# EAGLE design feeder_microcontroller_side (EAGLE 9.3.0)
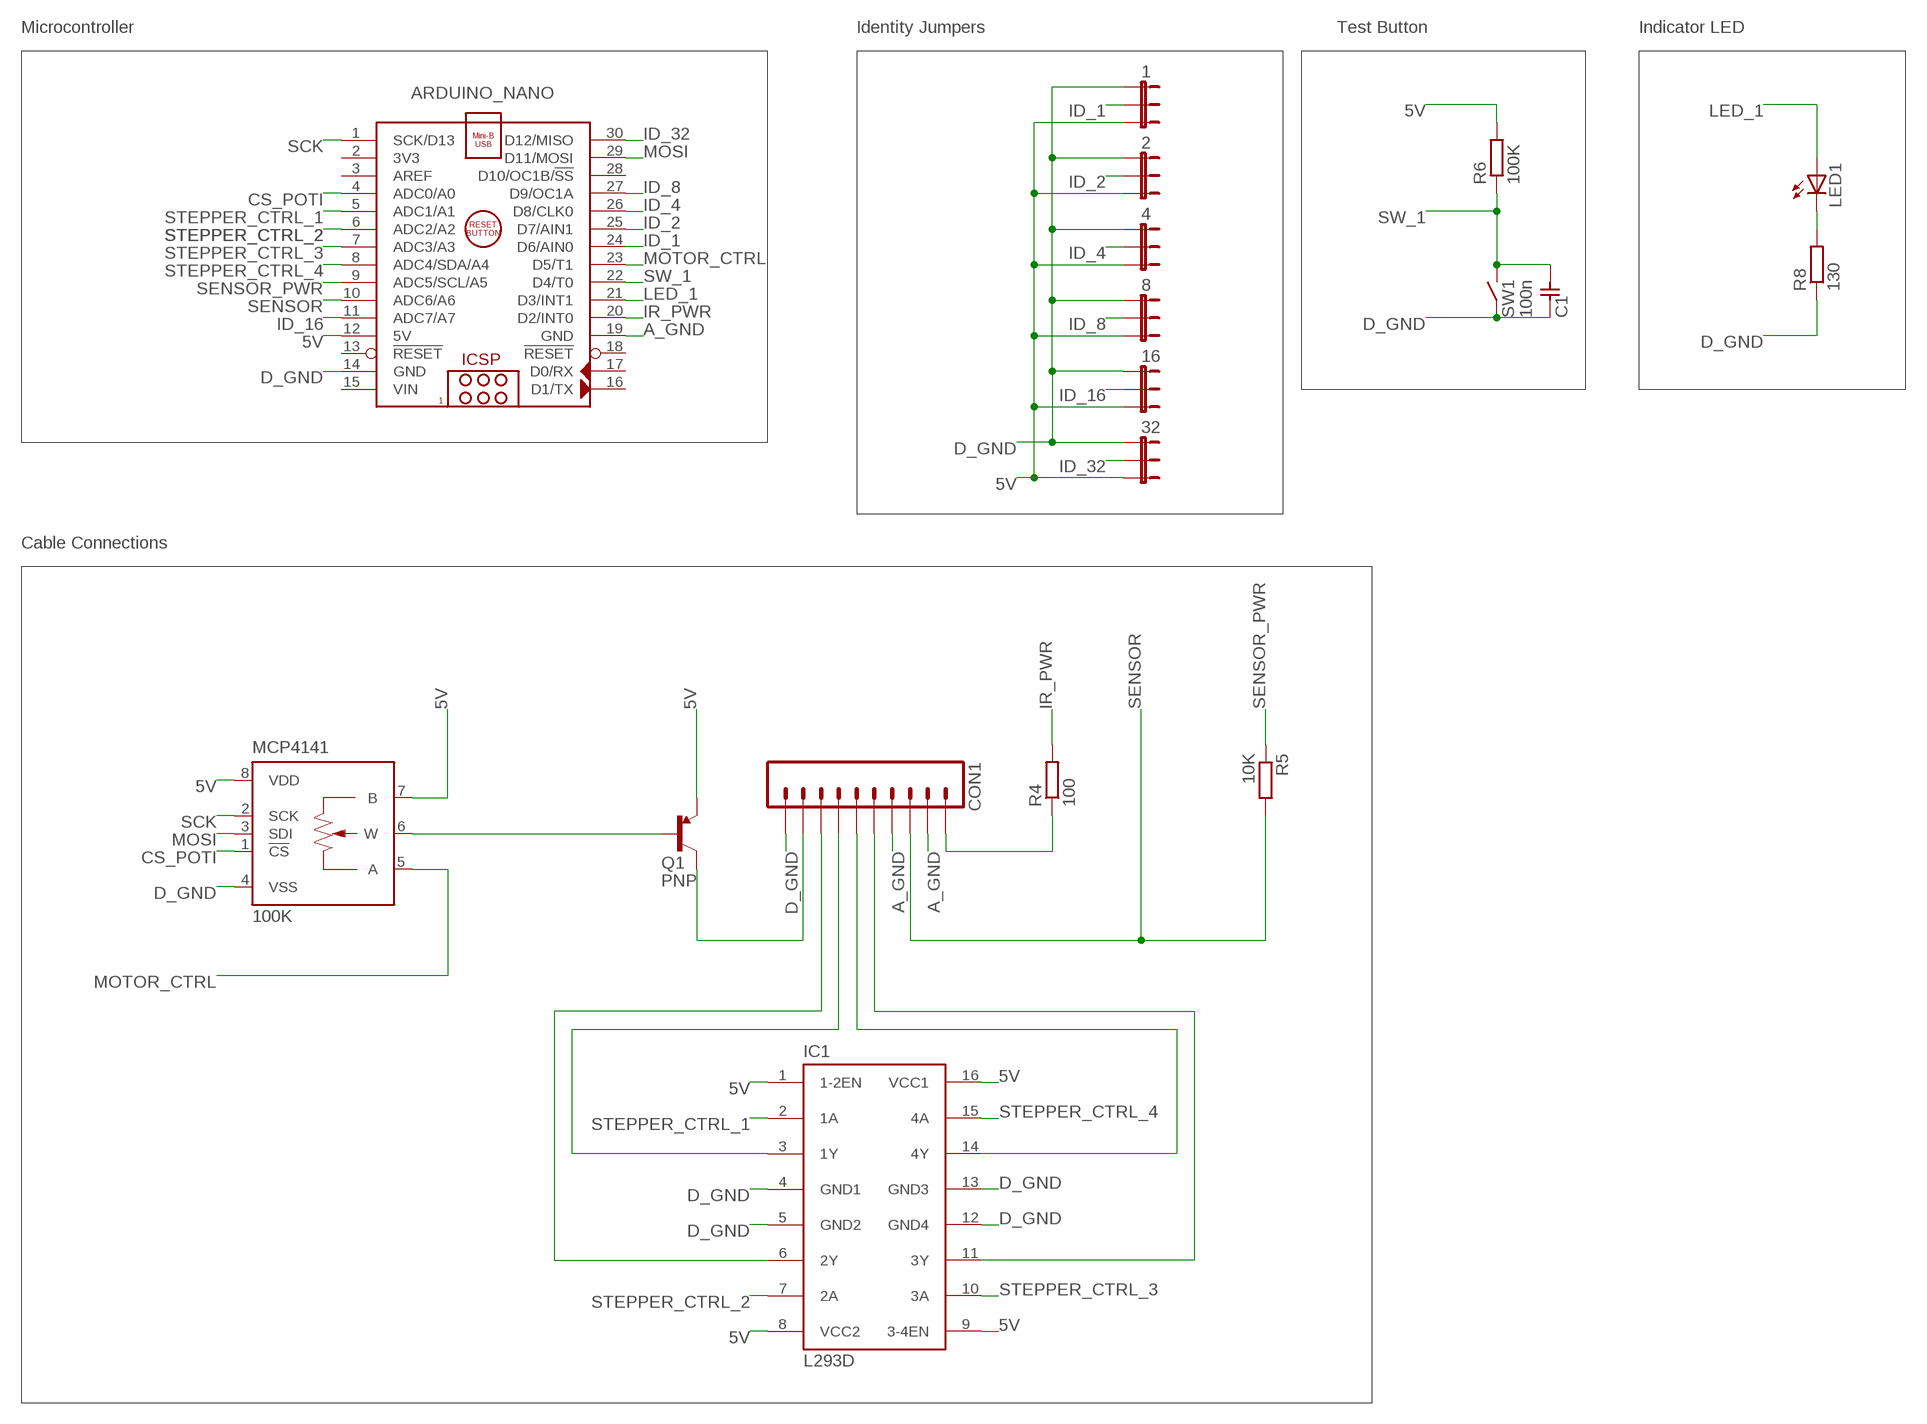
[diagram p0: schematic, sheet 1]

## Parts
1  JP2E  [JP2]
2  JP2E  [JP2]
4  JP2E  [JP2]
8  JP2E  [JP2]
16  JP2E  [JP2]
32  JP2E  [JP2]
ARDUINO_NANO  ARDUINO_NANO  [ARDUINO_NANO]
C1  100n  CAPACITOR  [CAPACITOR]
CON1  CON_10  [CON_10P_1.25_ALIEXPRESS]
IC1  L293D  [DIL16]
LED1  LED_3MM  [TCR5000_IR_EMITTER]
MCP4141  100K  MCP_41X1_DIGI_POT  [DIL08]
Q1  PNP  [TO92-]
R4  100  R-EU_0204/7  [0204/7]
R5  10K  R-EU_0204/7  [0204/7]
R6  100K  R-EU_0204/7  [0204/7]
R8  130  R-EU_0204/7  [0204/7]
SW1  BUTTON  [KS-01Q-01_BUTTON]

## Nets
5V [motor]: 1.3 2.3 4.3 8.3 16.3 32.3 ARDUINO_NANO.12(5V) IC1.1(1-2EN) IC1.8(VCC2) IC1.9(3-4EN) IC1.16(VCC1) MCP4141.7(B) MCP4141.8(VDD) Q1.E R6.2
A_GND: ARDUINO_NANO.19(GND) CON1.2 CON1.4
CS_POTI: ARDUINO_NANO.4(ADC0/A0) MCP4141.1(!CS)
D_GND [motor]: 1.1 2.1 4.1 8.1 16.1 32.1 ARDUINO_NANO.14(GND) C1.P$1 CON1.10 IC1.4(GND1) IC1.5(GND2) IC1.12(GND4) IC1.13(GND3) MCP4141.4(VSS) R8.1 SW1.1 SW1.3
ID_1: 1.2 ARDUINO_NANO.24(D6/AIN0)
ID_2: 2.2 ARDUINO_NANO.25(D7/AIN1)
ID_4: 4.2 ARDUINO_NANO.26(D8/CLK0)
ID_8: 8.2 ARDUINO_NANO.27(D9/OC1A)
ID_16: 16.2 ARDUINO_NANO.11(ADC7/A7)
ID_32: 32.2 ARDUINO_NANO.30(D12/MISO)
IR+: CON1.1 R4.1
IR_PWR: ARDUINO_NANO.20(D2/INT0) R4.2
LED_1: ARDUINO_NANO.21(D3/INT1) LED1.A
MOSI: ARDUINO_NANO.29(D11/MOSI) MCP4141.3(SDI)
MOTOR_CTRL: ARDUINO_NANO.23(D5/T1) MCP4141.5(A)
MOTOR_SUPPLY [motor]: CON1.9 Q1.C
N$16: MCP4141.6(W) Q1.B
N$19: LED1.C R8.2
SCK: ARDUINO_NANO.1(SCK/D13) MCP4141.2(SCK)
SENSOR: ARDUINO_NANO.10(ADC6/A6) CON1.3 R5.2
SENSOR_PWR: ARDUINO_NANO.9(ADC5/SCL/A5) R5.1
STEPPER_CTRL_1: ARDUINO_NANO.5(ADC1/A1) IC1.2(1A)
STEPPER_CTRL_2: ARDUINO_NANO.6(ADC2/A2) IC1.7(2A)
STEPPER_CTRL_3: ARDUINO_NANO.7(ADC3/A3) IC1.10(3A)
STEPPER_CTRL_4: ARDUINO_NANO.8(ADC4/SDA/A4) IC1.15(4A)
STEPPER_PWR_1: CON1.7 IC1.3(1Y)
STEPPER_PWR_2: CON1.8 IC1.6(2Y)
STEPPER_PWR_3: CON1.5 IC1.11(3Y)
STEPPER_PWR_4: CON1.6 IC1.14(4Y)
SW_1: ARDUINO_NANO.22(D4/T0) C1.P$2 R6.1 SW1.2 SW1.4
Unconnected: ARDUINO_NANO.2(3V3) ARDUINO_NANO.3(AREF) ARDUINO_NANO.13(!RESET) ARDUINO_NANO.16(D1/TX) ARDUINO_NANO.17(D0/RX) ARDUINO_NANO.18(!RESET) ARDUINO_NANO.28(D10/OC1B/!SS)

## Notes on the sheet
- Microcontroller | Identity Jumpers | Test Button | Indicator LED
- Cable Connections

## Power pins joined to a net without a drawn wire
VIN: ARDUINO_NANO.15(VIN)

## Library data of the parts
1 2 4 8 16 32 = Skinner_Box_Devices:JP2E: JUMPER
ARDUINO_NANO = Skinner_Box_Devices:ARDUINO_NANO: Arduino Nano V3.0 Module Overview: The Arduino Nano is a small, complete, and breadboard-friendly board based on the ATmega328 (Arduino Nano 3.x) or ATmega168 (Arduino Nano 2.x). It has more or less the same functionality of the Arduino Duemilanove, but in a different package. It lacks only a DC power jack, and works with a Mini-B USB cable instead of a standard one. The Nano was designed and is being produced by Gravitech <http://www.gravitech.us/arna30wiatp.html>. General specifications: Item Value Microcontroller Atmel ATmega168 or ATmega328 Operating Voltage (logic level) 5 V Input Voltage (recommended) 7-12 V Input Voltage (limits) 6-20 V Digital I/O Pins 14 (of which 6 provide PWM output) Analog Input Pins 8 DC Current per I/O Pin 40 mA Flash Memory 16 KB (ATmega168) or 32 KB (ATmega328) of which 2 KB used by bootloader SRAM 1 KB (ATmega168) or 2 KB (ATmega328) EEPROM 512 bytes (ATmega168) or 1 KB (ATmega328) Clock Speed 16 MHz Dimensions (Inches) 0.73" x 1.70" Dimensions (mm) 18mm x 45mm Overall height About 9 mm (not including pins) Weigth 5 g Power: The Arduino Nano can be powered via the Mini-B USB connection, 6-20V unregulated external power supply (pin 30), or 5V regulated external power supply (pin 27). The power source is automatically selected to the highest voltage source. Memory: The ATmega168 has 16 KB of flash memory for storing code (of which 2 KB is used for the bootloader); the ATmega328 has 32 KB, (also with 2 KB used for the bootloader). The ATmega168 has 1 KB of SRAM and 512 bytes of EEPROM (which can be read and written with the EEPROM library); the ATmega328 has 2 KB of SRAM and 1 KB of EEPROM. Input and Output: Each of the 14 digital pins on the Nano can be used as an input or output, using pinMode(), digitalWrite(), and digitalRead() functions. They operate at 5 volts. Each pin can provide or receive a maximum of 40 mA and has an internal pull-up resistor (disconnected by default) of 20-50 kOhms. In addition, some pins have specialized functions. Visit Arduino - ArduinoBoardNano <https://www.arduino.cc/en/Main/ArduinoBoardNano>
C1 = Skinner_Box_Devices:CAPACITOR
CON1 = Skinner_Box_Devices:CON_10
IC1 = Skinner_Box_Devices:L293D: PUSH-PULL 4 CHANNEL DRIVER
LED1 = Skinner_Box_Devices:LED_3MM
MCP4141 = Skinner_Box_Devices:MCP_41X1_DIGI_POT
Q1 = Skinner_Box_Devices:PNP: NPN Transistor
R4-R6 R8 = Skinner_Box_Devices:R-EU_: RESISTOR, European symbol
SW1 = Skinner_Box_Devices:BUTTON

## Net classes
0 default: width 0.1 mm, clearance 0.1 mm
1 motor: width 0.1 mm, clearance 0.2 mm

## Board
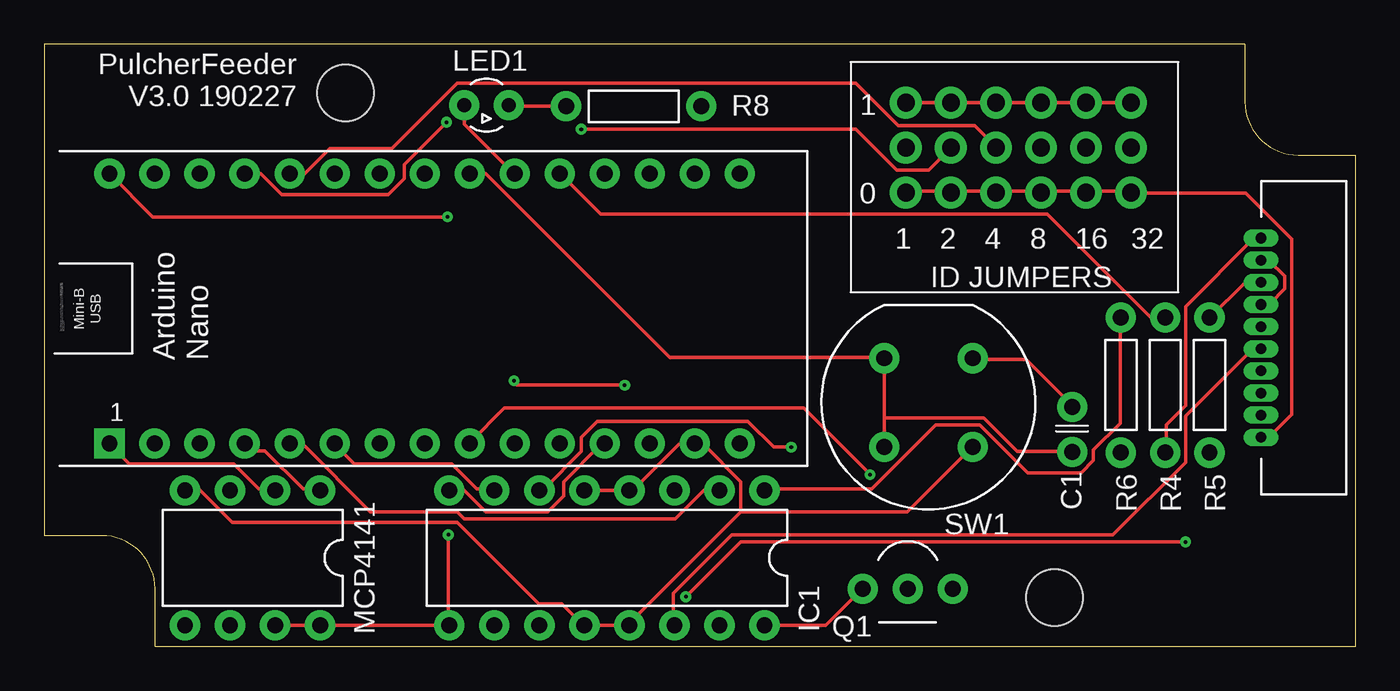
[diagram p1: board, top side]
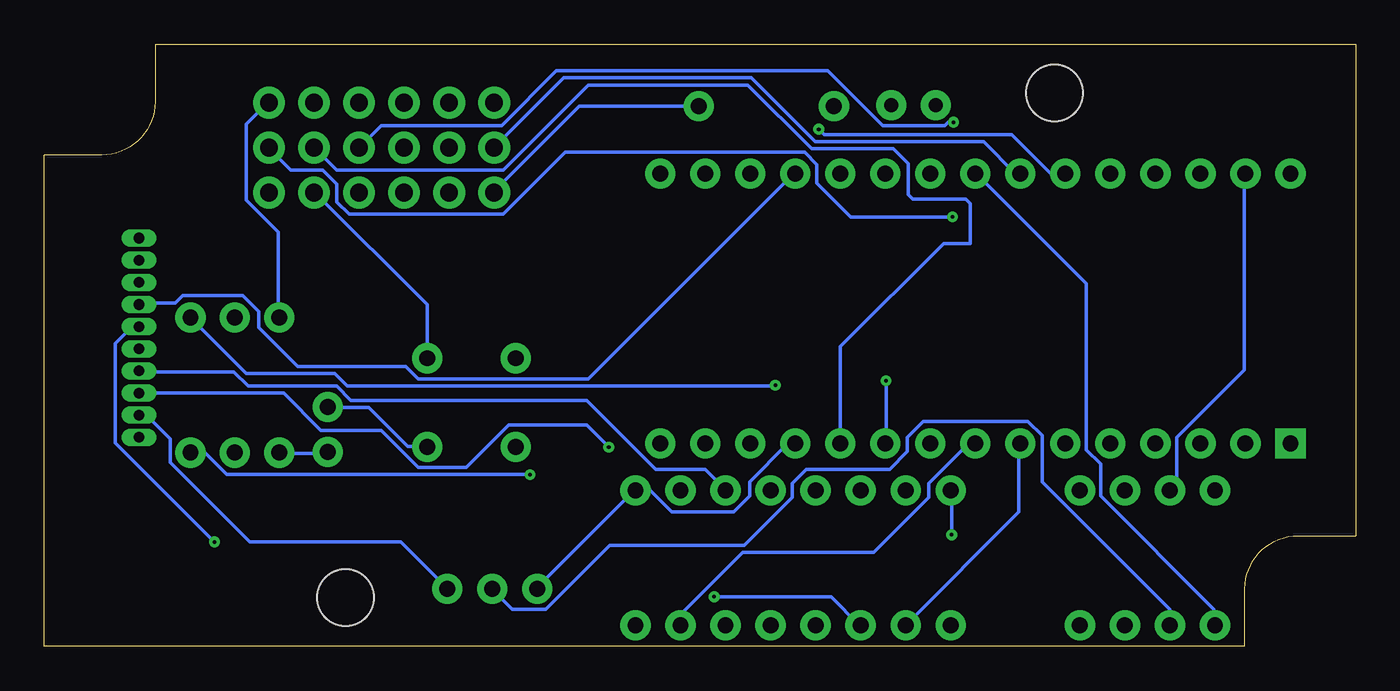
[diagram p2: board, bottom side, seen from below]

Size 74 x 34 mm. Coordinates in mm from the lower left corner, seen from the top.
Outline: 67.75,34 0,34 0,6.25 3.25,6.25 arc-90 6.25,3.25 6.25,0 74,0 74,27.75 70.75,27.75 arc-90 67.75,30.75 67.75,34
Copper layers (1*16): Top 0.035mm / dielectric 1.5mm / Bottom 0.035mm
Design rules "eagle_design_rules_multiCB": minimum track width 0.2mm, minimum drill 0.2mm, track to track 0.2mm, track to pad 0.2mm, pad to pad 0.2mm, via to via 0.2mm, smd to smd 0.2mm, copper to edge 0.2mm, drill to drill 0.2mm, minimum pad ring 0mil, minimum via ring 8mil, stop-mask expansion 4mil, vias tented up to drill 1mm, thermal gap 10mil
Holes 3.2 mm at 17,31.25 57,2.75
tRestrict: area 54,-0.2 to 60,5.8; area 14,28.2 to 20,34.2
bRestrict: area 14,28.2 to 20,34.2; area 54,-0.2 to 60,5.8

### Footprints (pad centres in the part's own frame; a part is rotated, then mirrored left to right if it is on the bottom)
JP2 = drill 1 pad 1.8: 1 -2.54,0; 2 0,0; 3 2.54,0
ARDUINO_NANO = drill 0.9 pad 1.7 square: 1 -20.32,-7.62 | drill 0.9 pad 1.7: 2 -17.78,-7.62; 3 -15.24,-7.62; 4 -12.7,-7.62; 5 -10.16,-7.62; 6 -7.62,-7.62; 7 -5.08,-7.62; 8 -2.54,-7.62; 9 0,-7.62; 10 2.54,-7.62; 11 5.08,-7.62; 12 7.62,-7.62; 13 10.16,-7.62; 14 12.7,-7.62; 15 15.24,-7.62; 16 15.24,7.62; 17 12.7,7.62; 18 10.16,7.62; 19 7.62,7.62; 20 5.08,7.62; 21 2.54,7.62; 22 0,7.62; 23 -2.54,7.62; 24 -5.08,7.62; 25 -7.62,7.62; 26 -10.16,7.62; 27 -12.7,7.62; 28 -15.24,7.62; 29 -17.78,7.62; 30 -20.32,7.62
CAPACITOR = drill 0.9 pad 1.7: P$1 -1.27,0; P$2 1.27,0
CON_10P_1.25_ALIEXPRESS = drill 0.6 pad 1 long: 1 3.225,0; 2 4.475,0; 3 5.725,0; 4 6.975,0; 5 8.225,0; 6 9.475,0; 7 10.725,0; 8 11.975,0; 9 13.225,0; 10 14.475,0
DIL16 = drill 0.9 pad 1.7: 1 -8.89,-3.81; 2 -6.35,-3.81; 3 -3.81,-3.81; 4 -1.27,-3.81; 5 1.27,-3.81; 6 3.81,-3.81; 7 6.35,-3.81; 8 8.89,-3.81; 9 8.89,3.81; 10 6.35,3.81; 11 3.81,3.81; 12 1.27,3.81; 13 -1.27,3.81; 14 -3.81,3.81; 15 -6.35,3.81; 16 -8.89,3.81
TCR5000_IR_EMITTER = drill 0.8 pad 1.7: A 0,1.25; C 0,-1.25
DIL08 = drill 0.9 pad 1.7: 1 -3.81,-3.81; 2 -1.27,-3.81; 3 1.27,-3.81; 4 3.81,-3.81; 5 3.81,3.81; 6 1.27,3.81; 7 -1.27,3.81; 8 -3.81,3.81
TO92- = drill 0.9 pad 1.7: B 0,0; C 2.54,0; E -2.54,0
0204/7 = drill 0.9 pad 1.7: 1 -3.81,0; 2 3.81,0
KS-01Q-01_BUTTON = drill 0.9 pad 1.7: 1 -2.5,-2.5; 2 2.5,-2.5; 3 -2.5,2.5; 4 2.5,2.5

### Placement (x,y rotation side)
1  48.62,28.16 90 top
2  51.16,28.16 90 top
4  53.7,28.16 90 top
8  56.24,28.16 90 top
16  58.78,28.16 90 top
32  61.32,28.16 90 top
ARDUINO_NANO  24,19.08 0 top
C1  58,12.25 270 top
CON1  68.66,26.28 270 top
IC1  31.75,5 180 top
LED1  24.95,30.56 90 top
MCP4141  11.75,5 180 top
Q1  48.72,3.25 0 top
R4  63.25,14.75 90 top
R5  65.75,14.75 90 top
R6  60.75,14.75 90 top
R8  33.25,30.5 180 top
SW1  49.89,13.77 180 top

### Tracks (layer width: path | path; a pad name or v marks a point on that pad's centre or on a via)
5V  (via drill 0.2)
  Top 0.2: 1.3 2.3 4.3 8.3 16.3 32.3 | IC1.16 40.7,1.2 44.1,1.2 46.1,3.2 Q1.E | MCP4141.7 13.1,1.2 15.5,1.2 MCP4141.8 15.6,1.2 22.8,1.2 IC1.9 22.8,1.3 v22.8,6.3 | IC1.8 22.9,8.8 23.7,8.8 24.9,7.6 28.4,7.6 29.3,8.5 29.3,9.3 31.4,11.4 31.6,11.4 ARDUINO_NANO.12 | R6.2 60.7,18.5 60.7,12.6 59.2,11.1 59.2,10.5 58.5,9.8 55.5,9.8 52.8,12.5 50.3,12.5 46.7,8.9 40.7,8.9 IC1.1
  Bottom 0.2: R6.2 60.8,18.6 60.8,23.4 62.6,25.2 62.6,29.5 61.4,30.7 32.3 | Q1.E 46.2,3.3 40.7,8.8 IC1.1 40.6,8.8 39.8,8.8 38.6,7.6 35.1,7.6 34.2,8.5 34.2,9.3 32.1,11.4 31.7,11.4 ARDUINO_NANO.12 | v22.8,6.3 22.8,8.8 IC1.8
A_GND
  Top 0.2: CON1.4 68.7,19.4 69.2,19.4 70,20.2 70,20.9 69.1,21.8 68.7,21.8 CON1.2
  Bottom 0.2: CON1.4 68.6,19.4 66.6,19.4 66.2,19.8 62.8,19.8 61.9,18.9 61.9,18 59.7,15.8 53.6,15.8 52.9,15.1 43.3,15.1 31.7,26.7 ARDUINO_NANO.19
CS_POTI
  Top 0.2: MCP4141.1 15.5,8.9 14.6,8.9 12.45,11.05 11.71,11.05 ARDUINO_NANO.4
D_GND
  Top 0.2: IC1.5 30.5,8.8 33,8.8 IC1.4 33.1,8.9 33.3,8.9 35.8,11.4 36.7,11.4 | MCP4141.4 8,8.8 8.8,8.8 10.6,7 23.3,7 27.9,2.4 29.2,2.4 30.4,1.2 IC1.12 30.5,1.2 33,1.2 IC1.13 33,1.3 39.3,7.6 | 36.7,11.4 37.2,11.4 39.3,9.3 39.3,7.6 | 36.7,11.4 ARDUINO_NANO.14 | CON1.10 68.7,11.9 69.2,11.9 70.4,13.1 70.4,23 67.8,25.6 61.4,25.6 32.1 61.3,25.7 58.8,25.7 16.1 58.7,25.7 56.3,25.7 8.1 56.2,25.7 53.7,25.7 | SW1.1 52.4,16.2 55.4,16.2 58,13.6 C1.P$1 | 1.1 48.7,25.7 51.1,25.7 2.1 51.2,25.7 53.7,25.7 | 53.7,25.7 4.1 | 39.3,7.6 48.7,7.6 52.3,11.2 SW1.3
  Bottom 0.2: SW1.3 52.4,11.3 53.5,11.3 55.7,13.5 58,13.5 C1.P$1 | R8.1 43.8,30.5 48.6,25.7 1.1 | SW1.1 52.4,16.3 52.4,19.3 58.7,25.6 16.1
ID_1
  Bottom 0.2: ARDUINO_NANO.24 19.2,26.7 21,28.5 30.5,28.5 34.1,32.1 44.7,32.1 48.6,28.2 1.2
ID_2  (via drill 0.2)
  Top 0.2: v30.3,29.2 45.8,29.2 48.1,26.9 49.9,26.9 2.2
  Bottom 0.2: ARDUINO_NANO.25 17.2,26.7 19.4,28.9 30,28.9 v30.3,29.2
ID_4
  Top 0.2: ARDUINO_NANO.26 14.7,26.7 16.1,28.1 19.6,28.1 23.3,31.8 45.8,31.8 48.2,29.4 52.5,29.4 53.7,28.2 4.2
ID_8  (via drill 0.2)
  Top 0.2: ARDUINO_NANO.27 12.2,26.7 13.4,25.5 19.4,25.5 20.3,26.4 20.3,27.2 v22.7,29.6
  Bottom 0.2: v22.7,29.6 23,29.6 23.2,29.4 26.7,29.4 29.8,32.5 45.1,32.5 48.2,29.4 55,29.4 8.2
ID_16
  Bottom 0.2: 16.2 58.7,28.1 57.5,26.9 48.1,26.9 43.3,31.7 34.3,31.7 30.7,28.1 26.1,28.1 25.25,27.25 25.25,25.5 25,25.25 22,25.25 21.75,25 21.75,22.75 23.25,22.75 29.08,16.92 ARDUINO_NANO.11
ID_32  (via drill 0.2)
  Top 0.2: ARDUINO_NANO.30 6.13,24.25 v22.75,24.25
  Bottom 0.2: 32.2 61.3,28.1 60.1,26.9 58.3,26.9 57.5,26.1 57.5,25.1 56.8,24.4 48.1,24.4 44.6,27.9 31.1,27.9 30.4,27.2 30.4,26.15 28.5,24.25 v22.75,24.25
IR+
  Top 0.2: CON1.1 68.6,23 68.2,23 64.4,19.2 64.4,13.6 63.3,12.5 63.3,11 R4.1
IR_PWR
  Top 0.2: R4.2 63.2,18.6 62.4,18.6 56.6,24.4 31.4,24.4 29.1,26.7 ARDUINO_NANO.20
LED_1
  Top 0.2: LED1.A 23.7,29.5 26.5,26.7 ARDUINO_NANO.21
MOSI
  Bottom 0.2: ARDUINO_NANO.29 6.3,26.7 6.3,15.6 10.1,11.8 10.1,9.2 10.4,8.9 MCP4141.3
MOTOR_CTRL
  Bottom 0.2: MCP4141.5 8,1.2 8,2.1 14.4,8.5 14.4,10.3 15.2,11.1 15.2,20.5 21.4,26.7 ARDUINO_NANO.23
MOTOR_SUPPLY
  Bottom 0.2: CON1.9 68.6,13 68.2,13 66.9,11.7 66.9,10.4 62.4,5.9 53.9,5.9 51.3,3.3 Q1.C
N$16
  Bottom 0.2: MCP4141.6 10.5,1.2 10.5,2.1 17.7,9.3 17.7,11.9 18.5,12.7 24.4,12.7 25.3,11.8 25.3,11 26.3,10 31,10 31.8,9.2 31.8,8.4 34.5,5.7 42.1,5.7 45.7,2.1 47.6,2.1 48.7,3.2 Q1.B
N$19
  Top 0.2: R8.2 26.2,30.5 LED1.C
SCK
  Top 0.2: MCP4141.2 13,8.9 12.1,8.9 10.7,10.3 4.8,10.3 3.7,11.4 ARDUINO_NANO.1
SENSOR  (via drill 0.2)
  Top 0.2: CON1.3 68.6,20.5 67.7,20.5 65.8,18.6 R5.2 | v26.5,15 arc90 26.75,14.75 v32.75,14.75
  Bottom 0.2: R5.2 65.7,18.5 62.6,15.4 57.6,15.4 56.9,14.7 32.8,14.7 arc-90 v32.75,14.75 | ARDUINO_NANO.10 arc-90 26.5,11.5 v26.5,15
SENSOR_PWR  (via drill 0.2)
  Top 0.2: v46.6,9.7 42.85,13.45 25.95,13.45 24,11.5 ARDUINO_NANO.9
  Bottom 0.2: v46.6,9.7 63.7,9.7 64.9,10.9 65.7,10.9 R5.1
STEPPER_CTRL_1
  Top 0.2: IC1.2 37.2,8.8 35.6,7.2 23.7,7.2 23.3,7.6 18.4,7.6 14.6,11.4 13.9,11.4 ARDUINO_NANO.5
STEPPER_CTRL_2
  Top 0.2: IC1.7 25.4,8.9 24.4,8.9 23,10.3 17.5,10.3 16.4,11.4 ARDUINO_NANO.6
STEPPER_CTRL_3
  Bottom 0.2: ARDUINO_NANO.7 19,11.4 19,7.6 IC1.10
STEPPER_CTRL_4
  Bottom 0.2: IC1.15 38.1,1.8 34.6,5.3 27.2,5.3 24.1,8.4 24.1,9.2 21.9,11.4 21.5,11.4 ARDUINO_NANO.8
STEPPER_PWR_1
  Bottom 0.2: CON1.7 68.6,15.5 63.3,15.5 62.5,14.7 57.5,14.7 56.7,13.9 43.4,13.9 39.5,10 36.7,10 35.6,8.9 IC1.3
STEPPER_PWR_2  (via drill 0.2)
  Top 0.2: v42.15,11.25 41.15,11.25 39.7,12.7 31.2,12.7 30.3,11.8 30.3,11 28.2,8.9 28,8.9 IC1.6
  Bottom 0.2: v42.15,11.25 43.4,12.5 47.8,12.5 50.2,10.1 52.9,10.1 55,12.2 58.4,12.2 60.5,14.3 68.6,14.3 CON1.8
STEPPER_PWR_3  (via drill 0.2)
  Top 0.2: v64.4,5.9 39.3,5.9 v36.2,2.8
  Bottom 0.2: v64.4,5.9 70,11.5 70,17.1 69.1,18 68.7,18 CON1.5 | v36.2,2.8 29.6,2.8 28,1.2 IC1.11
STEPPER_PWR_4
  Top 0.2: CON1.6 68.6,16.8 68.2,16.8 64.4,13 64.4,10.4 60.3,6.3 38.8,6.3 35.5,3 35.5,1.2 IC1.14
SW_1
  Top 0.2: 47.4,12.9 47.4,16.2 SW1.2 47.3,16.3 35.3,16.3 24.9,26.7 ARDUINO_NANO.22 | 47.4,12.9 47.4,11.3 SW1.4 | 47.4,12.9 53,12.9 54.9,11 58,11 C1.P$2
  Bottom 0.2: R6.1 60.7,10.9 58,10.9 C1.P$2

### Text on the board
tPlace: PulcherFeeder / V3.0 190227 | 1 | 0 | ID JUMPERS